# EAGLE schematic 100W-Tauchlampe (EAGLE 7.1.0)
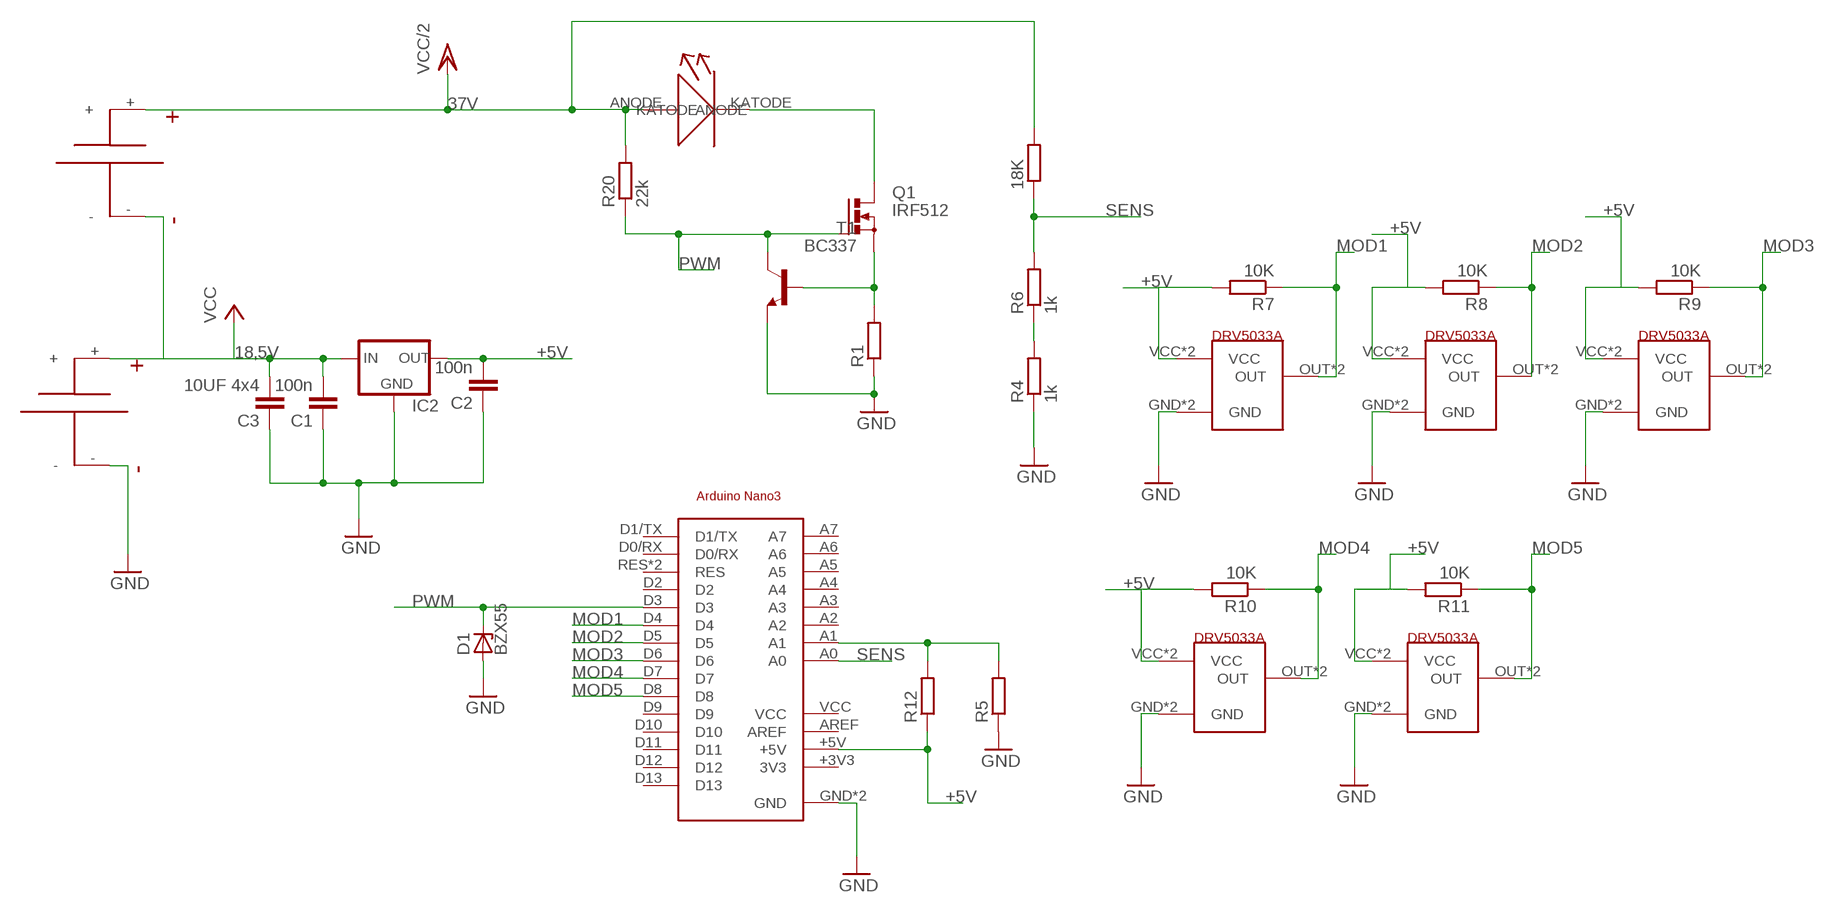
[diagram p0: schematic, sheet 1]

## Parts
1  DRV5033AJQLPGM  [T92/SOT23]
2  DRV5033AJQLPGM  [T92/SOT23]
3  DRV5033AJQLPGM  [T92/SOT23]
4  DRV5033AJQLPGM  [T92/SOT23]
5  DRV5033AJQLPGM  [T92/SOT23]
18K  R-EU_R0805  [R0805]
C1  100n  C-EUC0603  [C0603]
C2  100n  C-EUC0603  [C0603]
C3  10UF 4x4  C-EU  [4X4]
D1  BZX55  [DO35Z10]
IC2  78XXS  [78XXS]
Q1  IRF512  [TO220BV]
R1  R-EU_0207/2V  [0207/2V]
R4  1k  R-EU_R0805  [R0805]
R5  R-EU_R0805  [R0805]
R6  1k  R-EU_R0805  [R0805]
R7  10K  R-EU_R0805  [R0805]
R8  10K  R-EU_R0805  [R0805]
R9  10K  R-EU_R0805  [R0805]
R10  10K  R-EU_R0805  [R0805]
R11  10K  R-EU_R0805  [R0805]
R12  R-EU_0204/2V  [0204V]
R20  22k  R-EU_0204/2V  [0204V]
T1  BC337  [TO92]
U$1  ARDUINO-NANO3  [ARDUINO-NANO3]
U$7  100W-LED  [100W-LED]
U$8  AKKU  [AKKUSMD]
U$9  AKKU  [AKKUSMD]

## Nets
18,5V: C1.2 C3.P$2 IC2.IN U$8.- U$9.+ ; supply symbol labelled VCC
37V: 18K.2 R20.2 U$7.ANODE U$8.+ ; supply symbol labelled VCC/2
+5V: 2.VCC 2.VCC/SMD(VCC) 3.VCC 3.VCC/SMD(VCC) 5.VCC 5.VCC/SMD(VCC) C2.2 IC2.OUT R8.2 R9.2 R11.2 R12.1 U$1.+5V
GND: 1.GND 1.GND/SMD(GND) 2.GND 2.GND/SMD(GND) 3.GND 3.GND/SMD(GND) 4.GND 4.GND/SMD(GND) 5.GND 5.GND/SMD(GND) C1.1 C2.1 C3.1 D1.A IC2.GND R1.1 R4.1 R5.1 T1.1(E) U$1.GND U$1.GND2(GND) U$9.-
MOD1: 1.OUT 1.OUT/SMD(OUT) R7.1 U$1.D4
MOD2: 2.OUT 2.OUT/SMD(OUT) R8.1 U$1.D5
MOD3: 3.OUT 3.OUT/SMD(OUT) R9.1 U$1.D6
MOD4: 4.OUT 4.OUT/SMD(OUT) R10.1 U$1.D7
MOD5: 5.OUT 5.OUT/SMD(OUT) R11.1 U$1.D8
N$2: R5.2 R12.2 U$1.A1
N$3: Q1.S R1.2 T1.2(B)
N$4: 1.VCC 1.VCC/SMD(VCC) R7.2
N$7: Q1.D U$7.KATODE
N$10: 4.VCC 4.VCC/SMD(VCC) R10.2
N$11: R4.2 R6.1
PWM: D1.C Q1.G R20.1 T1.3(C) U$1.D3
SENS: 18K.1 R6.2 U$1.A0
Unconnected: U$1.+3V3(3V3) U$1.A2 U$1.A3 U$1.A4 U$1.A5 U$1.A6 U$1.A7 U$1.AREF U$1.D0/RX U$1.D1/TX U$1.D2 U$1.D9 U$1.D10 U$1.D11 U$1.D12 U$1.D13 U$1.RES U$1.RES2(RES) U$1.VCC

## Library data of the parts
1-5 = switch:DRV5033AJQLPGM
18K R1 R4-R12 R20 = rcl:R-EU_: RESISTOR, European symbol
C1-C3 = rcl:C-EU: CAPACITOR, European symbol
D1 = diode:BZX55: Z DIODE
IC2 = v-reg:78XXS: VOLTAGE REGULATOR
Q1 = transistor-power:IRF512: N-CHANNEL MOS FET
T1 = transistor:BC337: NPN TRANSISTOR
U$1 = ArduinoNano3:ARDUINO-NANO3
U$7 = 100w-led:100W-LED
U$8 U$9 = akku:AKKU